# Altium schematic sheet peripherals.SchDoc
size A; SheetNumber: 3; SheetTotal: 3
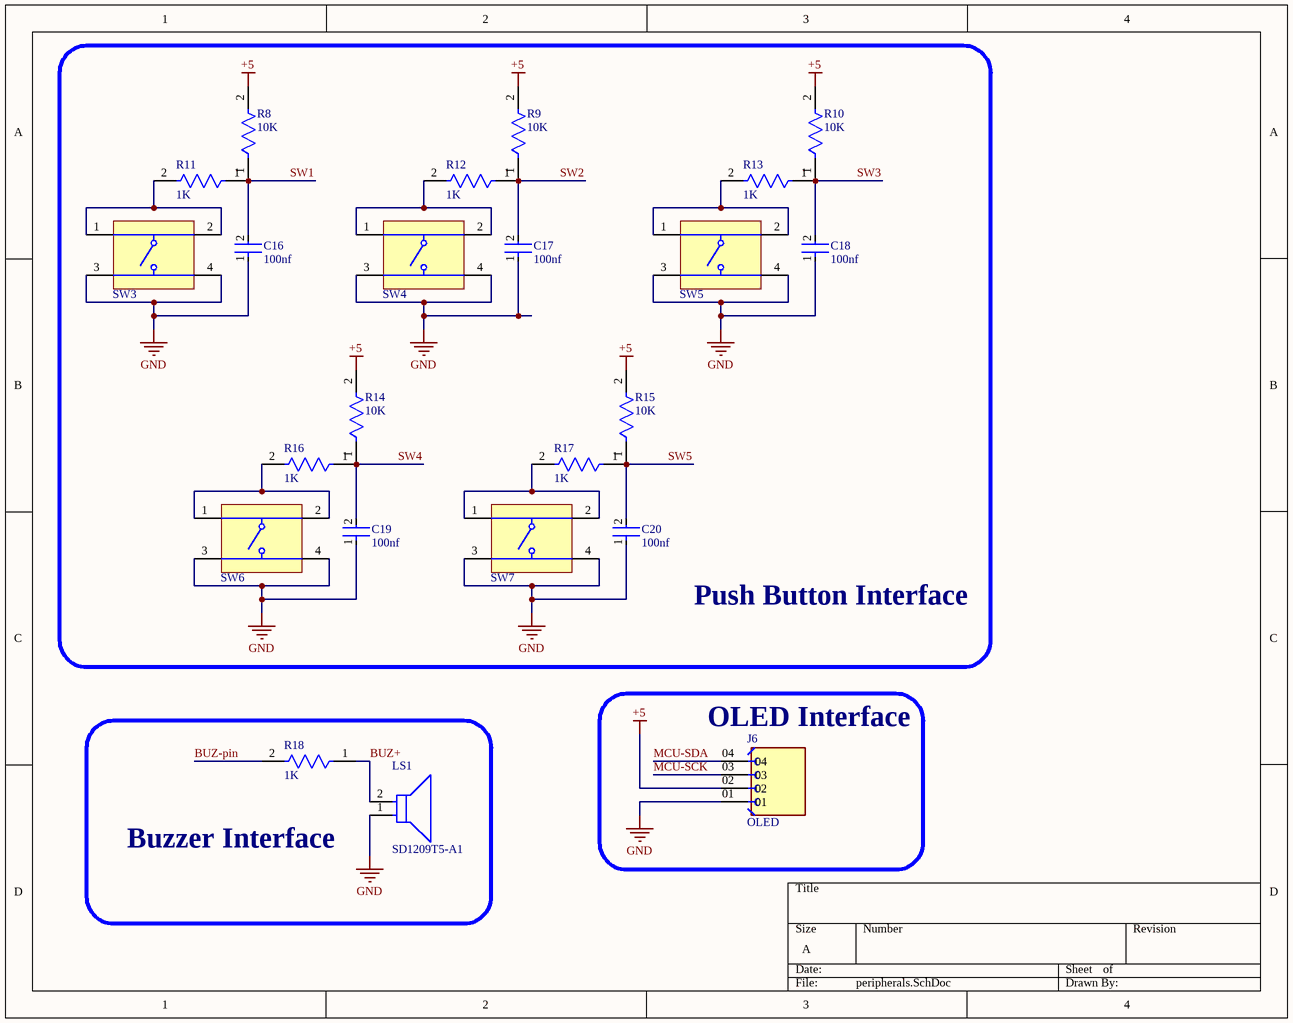
[diagram p0: peripherals.SchDoc]

## Parts
C16  100nf  [FP-CC0805-0_85-MFG]
C17  100nf  [FP-CC0805-0_85-MFG]
C18  100nf  [FP-CC0805-0_85-MFG]
C19  100nf  [FP-CC0805-0_85-MFG]
C20  100nf  [FP-CC0805-0_85-MFG]
J6  OLED  [AMPHENOL_75915-804]
LS1  SD1209T5-A1  [FP-SD1209-MFG]
R8  10K  [FP-CRCW0805-e3-MFG]
R9  10K  [FP-CRCW0805-e3-MFG]
R10  10K  [FP-CRCW0805-e3-MFG]
R11  1K  [FP-CRCW0805-e3-MFG]
R12  1K  [FP-CRCW0805-e3-MFG]
R13  1K  [FP-CRCW0805-e3-MFG]
R14  10K  [FP-CRCW0805-e3-MFG]
R15  10K  [FP-CRCW0805-e3-MFG]
R16  1K  [FP-CRCW0805-e3-MFG]
R17  1K  [FP-CRCW0805-e3-MFG]
R18  1K  [FP-CRCW0805-e3-MFG]
SW3  FSM4JSMATR  [TECO-FSM4JSMATR_V]  (value not drawn)
SW4  FSM4JSMATR  [TECO-FSM4JSMATR_V]  (value not drawn)
SW5  FSM4JSMATR  [TECO-FSM4JSMATR_V]  (value not drawn)
SW6  FSM4JSMATR  [TECO-FSM4JSMATR_V]  (value not drawn)
SW7  FSM4JSMATR  [TECO-FSM4JSMATR_V]  (value not drawn)

## Blocks framed on the sheet
Push Button Interface: C16-C20 R8-R17 SW3-SW7
Buzzer Interface: LS1 R18
OLED Interface: J6

## Nets
+5: J6.02 R8.2 R9.2 R10.2 R14.2 R15.2
GND: C16.1 C17.1 C18.1 C19.1 C20.1 J6.01 LS1.1(C) SW3.3 SW3.4 SW4.3 SW4.4 SW5.3 SW5.4 SW6.3 SW6.4 SW7.3 SW7.4
BUZ+: LS1.2(A) R18.1
BUZ-pin: R18.2
MCU-SCK: J6.03
MCU-SDA: J6.04
SW1: C16.2 R8.1 R11.1
SW2: C17.2 R9.1 R12.1
SW3: C18.2 R10.1 R13.1
SW4: C19.2 R14.1 R16.1
SW5: C20.2 R15.1 R17.1
NetR11_2: R11.2 SW3.1 SW3.2
NetR12_2: R12.2 SW4.1 SW4.2
NetR13_2: R13.2 SW5.1 SW5.2
NetR16_2: R16.2 SW6.1 SW6.2
NetR17_2: R17.2 SW7.1 SW7.2

## Library data of the parts
C16-C20 = CMP-2100-03606-3: CAP CER 0.1UF 50V X7R 0805; Manufacturer Part Number: CC0805KRX7R9BB104; Manufacturer: Yageo; Tolerance: 0.1; Material: Ceramic; Device Class L1: Passive Components; ComponentLink2Description: Datasheet; Package: CC0805-0.85; Digikey Description: CAP CER 0.1UF 50V X7R 0805; Capacitance: 100 nF; Device Class L3: Ceramic Capacitors; Value: 100 nF; Temperature: -30°C to +85°C; Temperature Characteristic: X7R; Voltage Rating: 50 V; Height: 0.95mm; RoHS: TRUE; Ipc Land Pattern Name: CAPC200125X85; Device Class L2: Capacitors; Category: Cap; Temperature Range Low: -30°C; Temperature Range High: +85°C; Mouser Description: Multilayer Ceramic Capacitors MLCC - SMD/SMT 100nF 50V X7R 10%; Footprint Url: http://www.yageo.com/exep/pages/download/literatures/UPY-C_GEN_24.pdf; Automotive: No; Octopart: https://octopart.com/cc0805krx7r9bb104-yageo-192993; Lead Free: Yes; ComponentLink2URL: http://www.yageo.com/documents/recent/UPY-GPHC_Y5V_6.3V-to-50V_8.pdf
J6 = 75915-804: DuboxÂ® 2.54mm, Board to Board Connector,Vertical Receptacle, Through Hole, Single row , 4 Positions, 2.54mm (0.100in) Pitch.; MF: Amphenol; Price: None; Purchase-URL: https://pricing.snapeda.com/search/part/75915-804/?ref=eda; Value: *; Check_prices: https://www.snapeda.com/parts/75915-804/Amphenol/view-part/?ref=eda; Package: None; SnapEDA_Link: https://www.snapeda.com/parts/75915-804/Amphenol/view-part/?ref=snap; MP: 75915-804; Availability: In Stock
LS1 = CMP-08413-000009-1: AUDIO MAGNETIC XDCR 3-6V TH; Max Supply Current: 60mA; Number of Terminals/Pins: 2; Frequency: 2.048kHz; Washable: No; Operating Supply Voltage: 5V; Self Resonant Frequency: 2.05kHz; Min Operating Temperature: -40°C; Operating Supply Current: 60mA; Diameter: 12mm; Package Quantity: 100; Max Operating Temperature: 85°C; Sensing Method: Magnetic; Series: SD; Current Rating: 60mA; Lead Free: Lead Free; Height: 9mm; Packaging: Tray; Termination: PC Pins; Number of Pins: 2; Voltage Rating (DC): 5V; Mount: Through Hole
R8-R18 = CMP-2001-04899-2: RES Thick Film, 100kΩ, 1%, 0.125W, 100ppm/°C, 0805; Resistance: 100kR; Power Rating: 125mW; Voltage Rating: 150V; Case/Package: 0805; Max Operating Temperature: 155°C; Case Code (Imperial): 0805; Lead Free: Lead Free; Weight: 0.000194oz; Number of Pins: 2; Package Quantity: 5000; Height: 0.45mm; Composition: Thick Film; Military Standard: Not; Tolerance: 1%; Case Code (Metric): 2012; Termination: SMD/SMT; Mount: Surface Mount; Radiation Hardening: No; Width: 1.25mm; Length: 2mm; Depth: 1.25mm; Packaging: Tape and Reel; Min Operating Temperature: -55°C; Contact Plating: Tin; Temperature Coefficient: 100ppm/°C; Voltage Rating (DC): 150V
SW3-SW7 = CMP-2000-07486-1: Micro Miniature Push Button Switch FSM JSM, 50 mA, -35 to 85 degC, 4-Pin SMD, RoHS, Tape and Reel; Manufacturer: TE Connectivity; Mechanical Life: 100000Cycles; Current Rating: 50mA; Actuator Material: Polyamide; Max Voltage Rating (DC): 12V; Capacitance: 0f; Illumination Type: Illuminated; Voltage Rating (DC): 24V; Case\/Package: SMD/SMT; Operating Force: 160gf; Contact Resistance: 100mOhm; Actuator Length: 0.055inch; Switch Travel: 0.25mm; Throw Configuration: SPST; Termination: GullWing; Contact Plating: Silver; Orientation: Straight; Mounting Technology: SurfaceMount; REACH SVHC: Unknown; Electrical Life: 100000Cycles; Package Reference: FSM4JSMATR; Max Operating Temperature: 85degC; Manufacturer URL: http://www.te.com/; Package Description: 4-Pin Surface Mount Device, Body 6 x 6 mm, Pitch 4.5 mm; Datasheet Version: Rev. V, 02/2015; Packaging: TapeandReel; Min Operating Temperature: -35degC; Mount: SurfaceMount; Contact Current Rating: 50mA; Contact Material: CopperAlloy; Package Quantity: 1200; Datasheet URL: http://www.te.com/commerce/DocumentDelivery/DDEController?Action=showdoc&DocId=Customer+Drawing%7F2-1437565-7%7FV%7Fpdf%7FEnglish%7FENG_CD_2-1437565-7_V.pdf%7F4-1437565-2; RoHSCompliant: true